# Altium project USB_Stepper_PCB.PrjPcb
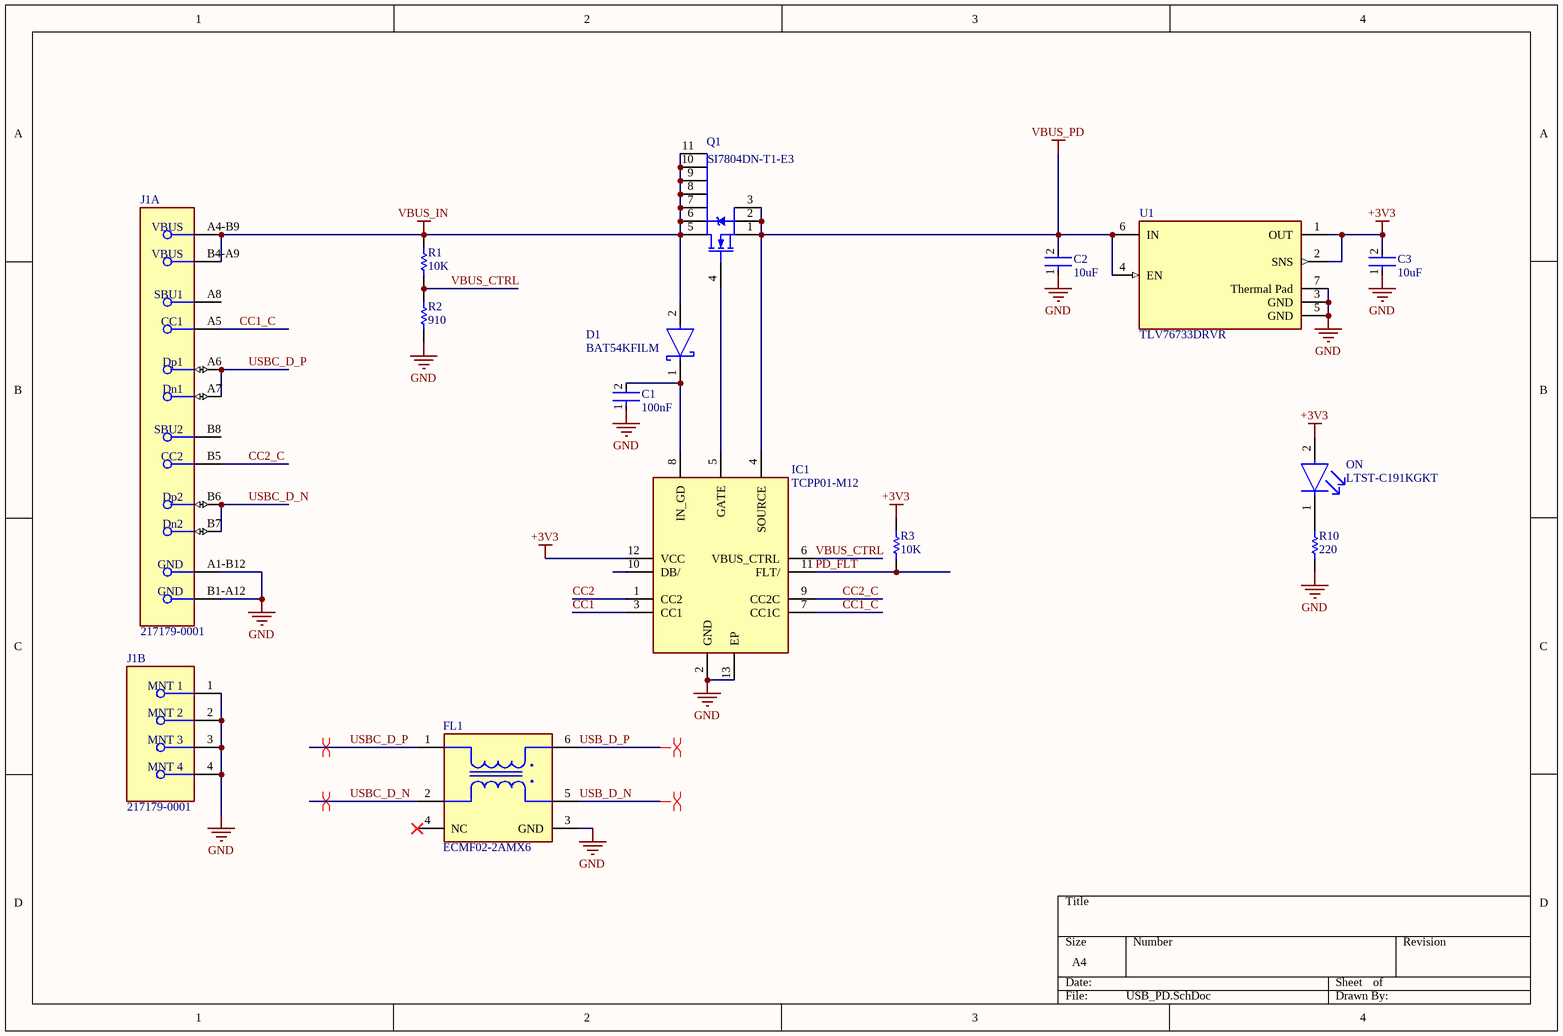
[diagram p0: USB_PD.SchDoc]
4 sheets, 36 parts. Net scope: global (net labels, ports and power ports of the same name join across sheets).
Board file: Top.PcbDoc
Sheets:
  USB_PD.SchDoc
  MCU.SchDoc
  DRIVER.SchDoc
  TOP.SchDoc

## Sheet USB_PD.SchDoc
size A4; SheetNumber: 1; SheetTotal: 4

### Parts
C1  Capacitance: 100nF  [FP-C1005-050-0_05-IPC_C]  (hidden comment: C1005X7R1H104K050BB)
C2  Capacitance: 10uF  [FP-C1608-080-IPC_A]  (hidden comment: C1608X5R1E106M080AC)
C3  Capacitance: 10uF  [FP-C1608-080-IPC_A]  (hidden comment: C1608X5R1E106M080AC)
D1  BAT54KFILM  [FP-SOD-523-MFG]
FL1  ECMF02-2AMX6  [FP-QFN-6L-MFG]
IC1  TCPP01-M12  [QFN50P300X300X100-13N-D]
J1  217179-0001  [FP-2171790001-MFG]  (parts A,B of 2)
ON  LTST-C191KGKT  [FP-LTST-C191KGKT-MFG]
Q1  SI7804DN-T1-E3  [SIS862DNT1GE3]
R1  Resistance: 10K  [RESC1005X40X25ML05T05]  (hidden comment: ERJ-2GEJ103X)
R2  ERJ-2GEJ103X: 910  [RESC1005X40X25ML05T05]  (hidden comment: ERJ-2GEJ911X)
R3  Resistance: 10K  [RESC1005X40X25ML05T05]  (hidden comment: ERJ-2GEJ103X)
R10  Resistance: 220  [RESC1005X40X25LL05T05]  (hidden comment: ERJ2RKF2200X)
U1  TLV76733DRVR  [FP-DRV0006A-IPC_C]

### Nets
+3V3: C3.2 IC1.12(VCC) ON.2(A) R3.2 U1.1(OUT) U1.2(SNS)
GND: C1.1 C2.1 C3.1 FL1.3(GND) IC1.2(GND) IC1.13(EP) J1.1(MNT_1) J1.2(MNT_2) J1.3(MNT_3) J1.4(MNT_4) J1.A1-B12(GND) J1.B1-A12(GND) R2.1 R10.2 U1.3(GND) U1.5(GND) U1.7(Thermal_Pad)
VBUS_IN: D1.2(A) J1.A4-B9(VBUS) J1.B4-A9(VBUS) Q1.5(D_1) Q1.6(D_2) Q1.7(D_3) Q1.8(D_4) Q1.9(D_5) Q1.10(D_6) Q1.11(D_7) R1.2
VBUS_PD: C2.2 IC1.4(SOURCE) Q1.1(S_1) Q1.2(S_2) Q1.3(S_3) U1.4(EN) U1.6(IN)
CC1: IC1.3(CC1)
CC1_C: IC1.7(CC1C) J1.A5(CC1)
CC2: IC1.1(CC2)
CC2_C: IC1.9(CC2C) J1.B5(CC2)
PD_~{FLT}: IC1.11(FLT/) R3.1
USB_D_N: FL1.5(D-)
USB_D_P: FL1.6(D+)
USBC_D_N: FL1.2(D-) J1.B6(Dp2) J1.B7(Dn2)
USBC_D_P: FL1.1(D+) J1.A6(Dp1) J1.A7(Dn1)
VBUS_CTRL: IC1.6(VBUS_CTRL) R1.1 R2.2
NetC1_2: C1.2 D1.1(C) IC1.8(IN_GD)
NetIC1_5: IC1.5(GATE) Q1.4(G)
NetON_1: ON.1(C) R10.1

Not connected (* = marked no-connect by the designer): FL1 4(NC)*; IC1 10(DB/); J1 A8(SBU1) B8(SBU2)

### Layout directives
differential pair: USB_D_N, USB_D_P, USBC_D_N, USBC_D_P

### Library data of the parts
C1 = CMP-2000-05393-2: Multilayer Ceramic Capacitors 100nF ±10% 50V X7R SMD 0402; Voltage: 50V; Dielectric Material: Ceramic; Min Operating Temperature: -55°C; Depth: 0.5mm; Radiation Hardening: No; RoHS Compliant: Yes; Voltage Rating (DC): 50V; Lead Free: Lead Free; Resistor Type: Ceramic; Height: 0.5mm; Dielectric: X7R; Thickness: 0.022inch; Case/Package: 0402; Case Code (Metric): 1005; Termination: SMD/SMT; Packaging: Tape and Reel; Max Operating Temperature: 125°C; Mount: Surface Mount; Package Quantity: 1; Width: 0.02inch; Weight: 2.3E-05oz; Voltage Rating: 50V; Tolerance: 10%; Construction: Flat; Case Code (Imperial): 0402; Length: 1mm; REACH SVHC: No SVHC; Series: C
C2 C3 = CMP-2000-05442-2: CAP CER 10UF 25V X5R 0603; Dielectric Material: Ceramic; Tolerance: 20%; Dielectric: X5R; Length: 1.6mm; Termination: SMD/SMT; Depth: 0.8mm; RoHS Compliant: Yes; Construction: Flat; Weight: 7.1E-05oz; Thickness: 0.039inch; Packaging: Tape and Reel; Min Operating Temperature: -55°C; Case Code (Imperial): 0603; Case/Package: 0603; Height: 0.8mm; Case Code (Metric): 1608; Voltage Rating: 25V; Resistor Type: Ceramic; Voltage Rating (DC): 25V; Max Operating Temperature: 85°C; REACH SVHC: No SVHC; Lead Free: Lead Free; Series: C; Width: 0.8mm; Mount: Surface Mount; Package Quantity: 1
D1 = CMP-12187-000026-1: DIODE SCHOTTKY 40V 300MA SOD523; Manufacturer: STMicroelectronics; Capacitance: 7pF; Value: 7pF; Max Surge Forward Current: 1.25A; Peak Reverse Current: 1uA; Max Junction Temp: +150°C; Device Class L2: Diodes; Temperature Range Low: -40°C; Category: Diode; Manufacturer Part Number: BAT54KFILM; Digikey Description: DIODE SCHOTTKY 40V 300MA SOD523; Device Class L3: Schottky Diodes; Automotive: No; Height: 0.7mm; Octopart: https://octopart.com/bat54kfilm-stmicroelectronics-39618022; ComponentLink2Description: Datasheet; Temperature Range High: +150°C; Device Class L1: Discrete Semiconductors; Max Repetitive Reverse Voltage: 40V; RoHS: TRUE; Temperature: -40°C to +150°C; ComponentLink2URL: https://www.st.com/content/ccc/resource/technical/document/datasheet/07/50/54/f2/0d/ba/4a/79/CD00001322.pdf/files/CD00001322.pdf/jcr:content/translations/en.CD00001322.pdf; Lead Free: Yes; Forward Current: 300mA; Package: SOD-523; Mouser Description: Schottky Diodes & Rectifiers schottky diode
FL1 = CMP-12075-000001-1: CMC 200MA 2LN SMD ESD; Manufacturer: STMicroelectronics; Standoff Height: 0mm; Max Junction Temp: +125°C; Series Resistance: 2.5Ω; Device Class L2: EMI / RFI Components; Device Class L1: Passive Components; Height: 0.55mm; Lead Free: Yes; Package: QFN-6L; Temperature Range Low: -55°C; Octopart: https://octopart.com/ecmf02-2amx6-stmicroelectronics-44353078; Mouser Description: TVS Diodes / ESD Suppressors ESD Mode Filter 6GHz USB 2.0 MIPI 8kV; Device Class L3: Common Mode Chokes; ComponentLink2URL: https://www.st.com/resource/en/datasheet/ecmf02-2amx6.pdf; Ipc Land Pattern Name: DFN170X150X50-6; ComponentLink2Description: Datasheet; Automotive: No; Temperature Range High: +125°C; Temperature: -55°C to +125°C; RoHS: TRUE; Digikey Description: CMC 200MA 2LN SMD ESD; Manufacturer Part Number: ECMF02-2AMX6; Category: Filter
IC1 = TCPP01-M12: Integrated Circuit; Manufacturer_Name: STMicroelectronics; Datasheet Link: https://www.st.com/resource/en/datasheet/tcpp01-m12.pdf; Height: 1mm; Manufacturer_Part_Number: TCPP01-M12; Mouser Part Number: 511-TCPP01-M12; Mouser Price/Stock: https://www.mouser.co.uk/ProductDetail/STMicroelectronics/TCPP01-M12?qs=%252B6g0mu59x7KCafIwapwG2A%3D%3D; Arrow Part Number: TCPP01-M12; Arrow Price/Stock: https://www.arrow.com/en/products/tcpp01-m12/stmicroelectronics?utm_currency=USD&region=nac
J1 = CMP-04767-000028-2: CONN RCP USB2.0 TYP C 24P SMD RA; NexarPartId: 117190526; Gender: Receptacle; Number of Contacts: 16; Current Rating: 1.25A; Voltage Rating: 30V; Min Operating Temperature: -40°C; USB Standard: USB 2.0; Height: 3.36mm; Contact Material: Gold, Nickel; Max Operating Temperature: 85°C
ON = CMP-2000-05198-4: NexarPartId: 549907; Forward Voltage: 2V; Viewing Angle: 130°; Lens Transparency: Clear; Power Rating: 75mW; Number of LEDs: 1; Luminous Intensity: 35mcd; Forward Current: 20mA; Dominant Wavelength: 571nm; Illumination Color: Green; Lens Color: Clear, Colorless; Reverse Voltage: 5V; Wavelength: 574nm; Number of Pins: 2; Packaging: Tape and Reel; Number of Elements: 1; Schedule B: 8541402000, 8541402000; Height: 550µm; Case/Package: 0603; Depth: 800µm; Max Operating Temperature: 85°C; RoHS: Compliant; Lens Style: Clear; Lead Free: Lead Free; Length: 1.6mm; Mount: Surface Mount; Test Current: 20mA; Width: 800µm; Case Code (Imperial): 0603; Min Operating Temperature: -55°C; Case Code (Metric): 1608; Radiation Hardening: No; Power Dissipation: 75mW; Color: Green
Q1 = SI7804DN-T1-E3: MOSFET (N-Channel); Manufacturer_Name: Vishay; Datasheet Link: https://componentsearchengine.com/Datasheets/1/SI7804DN-T1-E3.pdf; Height: 1.12mm; Manufacturer_Part_Number: SI7804DN-T1-E3; Mouser Part Number: 781-SI7804DN-T1-E3; Mouser Price/Stock: https://www.mouser.co.uk/ProductDetail/Vishay-Semiconductors/SI7804DN-T1-E3?qs=jcx%252B0HVgj2biudZDRPx5dA%3D%3D; Arrow Part Number: SI7804DN-T1-E3; Arrow Price/Stock: https://www.arrow.com/en/products/si7804dn-t1-e3/vishay
R1 R3 = CMP-2002-00433-1: Manufacturer: Panasonic; Part Number: ERJ-2GEJ103X
R2 = CMP-1011-00073-2: Manufacturer: Panasonic; Part Number: ERJ-2GEJ911X
R10 = CMP-2002-01131-1: Manufacturer: Panasonic; Part Number: ERJ2RKF2200X
U1 = CMP-04917-000203-1: VOLTAGE COMPARATOR

## Sheet MCU.SchDoc
size A; SheetNumber: 2; SheetTotal: 4
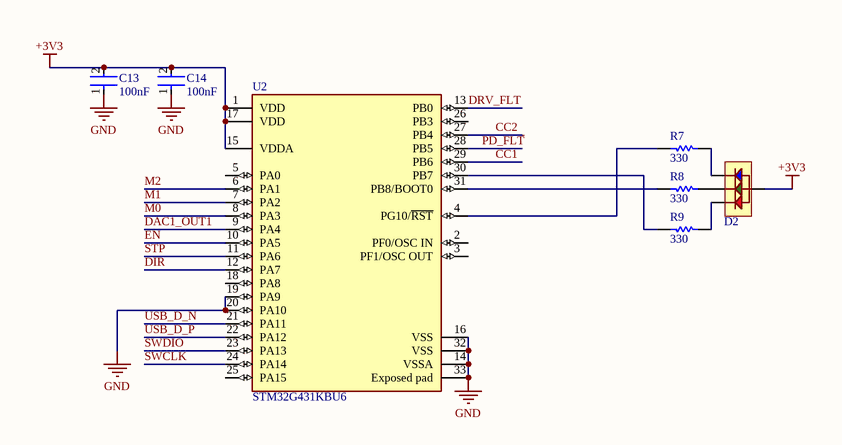
[diagram p1: MCU.SchDoc]

### Parts
C13  Capacitance: 100nF  [FP-C1005-050-0_05-IPC_C]  (hidden comment: C1005X7R1H104K050BB)
C14  Capacitance: 100nF  [FP-C1005-050-0_05-IPC_C]  (hidden comment: C1005X7R1H104K050BB)
D2  LED-RGB  [XL-2012RGBC]  (value not drawn)
R7  RESISTANCE: 330  [RESC1005X40X25NL05T05]  (hidden comment: ERJ-2GEJ331X)
R8  RESISTANCE: 330  [RESC1005X40X25NL05T05]  (hidden comment: ERJ-2GEJ331X)
R9  RESISTANCE: 330  [RESC1005X40X25NL05T05]  (hidden comment: ERJ-2GEJ331X)
U2  STM32G431KBU6  [FP-UFQFPN32-A0B8-IPC_A]

### Nets
+3V3: C13.2 C14.2 D2.3(COM) U2.1(VDD) U2.15(VDDA) U2.17(VDD)
GND: C13.1 C14.1 U2.14(VSSA) U2.16(VSS) U2.19(PA9) U2.20(PA10) U2.32(VSS) U2.33(Exposed_pad)
CC1: U2.29(PB6)
CC2: U2.27(PB4)
DAC1_OUT1: U2.9(PA4)
DIR: U2.12(PA7)
DRV_FLT: U2.13(PB0)
EN: U2.10(PA5)
M0: U2.8(PA3)
M1: U2.7(PA2)
M2: U2.6(PA1)
PD_~{FLT}: U2.28(PB5)
STP: U2.11(PA6)
SWCLK: U2.24(PA14)
SWDIO: U2.23(PA13)
USB_D_N: U2.21(PA11)
USB_D_P: U2.22(PA12)
NetD2_1: D2.1(R) R9.2
NetD2_2: D2.2(G) R8.2
NetD2_4: D2.4(B) R7.2
NetR7_1: R7.1 U2.4(PG10/~{RST})
NetR8_1: R8.1 U2.31(PB8/BOOT0)
NetR9_1: R9.1 U2.30(PB7)

Not connected (* = marked no-connect by the designer): U2 2(PF0/OSC_IN) 3(PF1/OSC_OUT) 5(PA0) 18(PA8) 25(PA15) 26(PB3)

### Library data of the parts
C13 C14 = CMP-2000-05393-2: as C1 on sheet USB_PD; Voltage: 50V; Dielectric Material: Ceramic; Min Operating Temperature: -55°C; Depth: 0.5mm; Radiation Hardening: No; RoHS Compliant: Yes; Voltage Rating (DC): 50V; Lead Free: Lead Free; Resistor Type: Ceramic; Height: 0.5mm; Dielectric: X7R; Thickness: 0.022inch; Case/Package: 0402; Case Code (Metric): 1005; Termination: SMD/SMT; Packaging: Tape and Reel; Max Operating Temperature: 125°C; Mount: Surface Mount; Package Quantity: 1; Width: 0.02inch; Weight: 2.3E-05oz; Voltage Rating: 50V; Tolerance: 10%; Construction: Flat; Case Code (Imperial): 0402; Length: 1mm; REACH SVHC: No SVHC; Series: C
D2 = XL-2012RGBC
R7-R9 = CMP-2002-00515-1: Manufacturer: Panasonic; Part Number: ERJ-2GEJ331X
U2 = CMP-12105-000119-1: IC MCU 32BIT 128KB FLSH 32UFQFPN; RoHS Compliant: Yes

## Sheet DRIVER.SchDoc
size A4; SheetNumber: 3; SheetTotal: 4
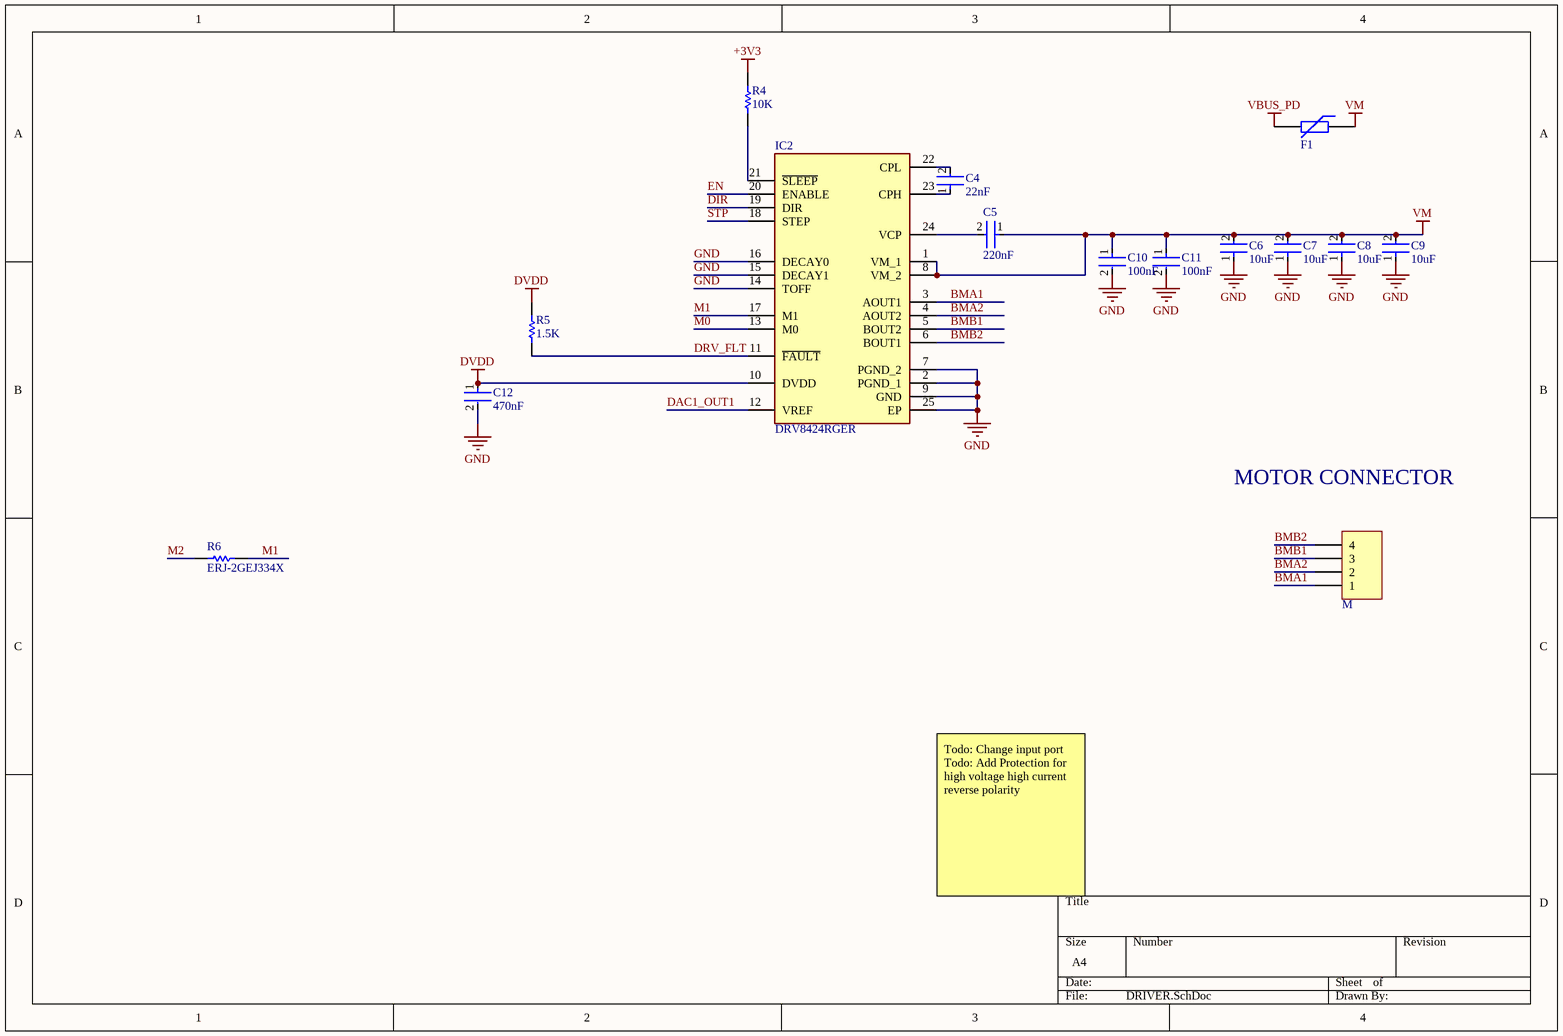
[diagram p2: DRIVER.SchDoc]

### Parts
C4  Capacitance: 22nF  [FP-C1005-050-0_05-IPC_C]  (hidden comment: C1005X7R1H223K050BB)
C5  Capacitance: 220nF  [FP-C1005-050-0_05-IPC_B]  (hidden comment: C1005X7R1V224K050BC)
C6  Capacitance: 10uF  [FP-C2012-125-0_2-IPC_B]  (hidden comment: C2012X5R1V106K125AC)
C7  Capacitance: 10uF  [FP-C2012-125-0_2-IPC_B]  (hidden comment: C2012X5R1V106K125AC)
C8  Capacitance: 10uF  [FP-C2012-125-0_2-IPC_B]  (hidden comment: C2012X5R1V106K125AC)
C9  Capacitance: 10uF  [FP-C2012-125-0_2-IPC_B]  (hidden comment: C2012X5R1V106K125AC)
C10  Capacitance: 100nF  [FP-C1005-050-0_05-IPC_C]  (hidden comment: C1005X7R1H104K050BB)
C11  Capacitance: 100nF  [FP-C1005-050-0_05-IPC_C]  (hidden comment: C1005X7R1H104K050BB)
C12  Capacitance: 470nF  [FP-C1005-050-0_05-IPC_B]  (hidden comment: C1005X5R1V474K050BC)
F1  (no value)  [R1206]
IC2  DRV8424RGER  [QFN50P400X400X100-25N-D]
M  CONN-4  [XH-4]  (value not drawn)
R4  RESISTANCE: 10K  [RESC1005X40X25ML05T05]  (hidden comment: ERJ-2GEJ103X)
R5  RESISTANCE: 1.5K  [RESC1005X40X25NL05T05]  (hidden comment: ERJ-2GEJ152X)
R6  ERJ-2GEJ334X  [RESC1005X40X25ML05T05]

### Nets
+3V3: R4.1
DVDD: C12.1 IC2.10(DVDD) R5.1
GND: C6.1 C7.1 C8.1 C9.1 C10.2 C11.2 C12.2 IC2.2(PGND_1) IC2.7(PGND_2) IC2.9(GND) IC2.14(TOFF) IC2.15(DECAY1) IC2.16(DECAY0) IC2.25(EP)
VBUS_PD: F1.2
VM: C5.1 C6.2 C7.2 C8.2 C9.2 C10.1 C11.1 F1.1 IC2.1(VM_1) IC2.8(VM_2)
BMA1: IC2.3(AOUT1) M.1
BMA2: IC2.4(AOUT2) M.2
BMB1: IC2.5(BOUT2) M.3
BMB2: IC2.6(BOUT1) M.4
DAC1_OUT1: IC2.12(VREF)
DIR: IC2.19(DIR)
DRV_FLT: IC2.11(~{FAULT}) R5.2
EN: IC2.20(ENABLE)
M0: IC2.13(M0)
M1: IC2.17(M1) R6.2
M2: R6.1
STP: IC2.18(STEP)
NetC4_1: C4.1 IC2.23(CPH)
NetC4_2: C4.2 IC2.22(CPL)
NetC5_2: C5.2 IC2.24(VCP)
NetIC2_21: IC2.21(~{SLEEP}) R4.2

### Notes on the sheet
- MOTOR CONNECTOR
- Todo: Change input port
  Todo: Add Protection for high voltage high current reverse polarity

### Library data of the parts
C4 = CMP-08246-004483-1: Multilayer Ceramic Capacitors 22nF ±10% 50V X7R SMD 0402; Radiation Hardening: No; Voltage Rating: 50V; Case Code (Imperial): 0402; Depth: 0.5mm; REACH SVHC: No SVHC; Dielectric Material: Ceramic; Package Quantity: 1; Length: 1mm; Case/Package: 0402; Voltage Rating (DC): 50V; Tolerance: 10%; Resistor Type: Ceramic; Thickness: 0.022inch; Weight: 2.3E-05oz; Min Operating Temperature: -55°C; Dielectric: X7R; RoHS Compliant: Yes; Number of Pins: 2; Termination: SMD/SMT; Mount: Surface Mount; Series: C; Height: 0.5mm; Max Operating Temperature: 125°C; Packaging: Tape and Reel; Case Code (Metric): 1005; Width: 0.02inch; Construction: Flat; Lead Free: Lead Free
C5 = CMP-08246-006551-1: Multilayer Ceramic Capacitors 220nF ±10% 35V X7R SMD 0402; Thickness: 0.022inch; Mount: Surface Mount; Width: 0.02inch; Voltage Rating (DC): 35V; Package Quantity: 10000; Case Code (Imperial): 0402; Height: 0.5mm; Termination: SMD/SMT; Weight: 2.3E-05oz; RoHS Compliant: Yes; Min Operating Temperature: -55°C; Case/Package: 0402; Length: 0.039inch; Max Operating Temperature: 125°C; Dielectric Material: Ceramic; Dielectric: X7R; Tolerance: 10%; Packaging: Tape and Reel; Voltage Rating: 35V; Lead Free: Lead Free; Case Code (Metric): 1005
C6-C9 = CMP-08246-003469-1: Multilayer Ceramic Capacitors 10μF ±10% 35V X5R SMD 0805; Packaging: Tape and Reel; RoHS Compliant: Yes; Mount: Surface Mount; Series: C; Case/Package: 0805; Voltage Rating (DC): 35V; Lead Free: Lead Free; Weight: 0.000194oz; Max Operating Temperature: 85°C; Tolerance: 10%; Thickness: 0.057inch; Voltage Rating: 35V; Height: 1.25mm; Length: 0.079inch; Dielectric Material: Ceramic; Case Code (Imperial): 0805; Dielectric: X5R; Case Code (Metric): 2012; Min Operating Temperature: -55°C; Termination: SMD/SMT; Package Quantity: 2000; Width: 1.25mm; REACH SVHC: No SVHC
C10 C11 = CMP-2000-05393-2: as C1 on sheet USB_PD; Voltage: 50V; Dielectric Material: Ceramic; Min Operating Temperature: -55°C; Depth: 0.5mm; Radiation Hardening: No; RoHS Compliant: Yes; Voltage Rating (DC): 50V; Lead Free: Lead Free; Resistor Type: Ceramic; Height: 0.5mm; Dielectric: X7R; Thickness: 0.022inch; Case/Package: 0402; Case Code (Metric): 1005; Termination: SMD/SMT; Packaging: Tape and Reel; Max Operating Temperature: 125°C; Mount: Surface Mount; Package Quantity: 1; Width: 0.02inch; Weight: 2.3E-05oz; Voltage Rating: 50V; Tolerance: 10%; Construction: Flat; Case Code (Imperial): 0402; Length: 1mm; REACH SVHC: No SVHC; Series: C
C12 = CMP-08246-003870-1: Multilayer Ceramic Capacitors 470nF ±10% 35V X5R SMD 0402; Voltage Rating: 35V; Package Quantity: 10000; RoHS Compliant: Yes; Height: 0.5mm; Termination: SMD/SMT; Tolerance: 10%; Length: 0.039inch; Dielectric Material: Ceramic; Dielectric: X5R; Min Operating Temperature: -55°C; Case Code (Imperial): 0402; Mount: Surface Mount; Max Operating Temperature: 85°C; Voltage Rating (DC): 35V; Packaging: Tape and Reel; Width: 0.02inch; Case/Package: 0402; Series: C; Weight: 2.3E-05oz; Case Code (Metric): 1005; Lead Free: Lead Free; Thickness: 0.022inch
F1 = PTC: Published: 24-Mar-1999; PackageVersion: Mar-2003; PackageReference: 6-0805
IC2 = DRV8424RGER: Integrated Circuit; Manufacturer_Name: Texas Instruments; Datasheet Link: https://www.ti.com/lit/ds/symlink/drv8424e.pdf?ts=1606468050255; Height: 1mm; Manufacturer_Part_Number: DRV8424RGER; Mouser Part Number: 595-DRV8424RGER; Mouser Price/Stock: https://www.mouser.co.uk/ProductDetail/Texas-Instruments/DRV8424RGER?qs=zW32dvEIR3vjkIn0AjQrCA%3D%3D; Arrow Part Number: DRV8424RGER; Arrow Price/Stock: null?region=nac
R4 = CMP-2002-00433-1: Manufacturer: Panasonic; Part Number: ERJ-2GEJ103X
R5 = CMP-1011-00078-2: Manufacturer: Panasonic; Part Number: ERJ-2GEJ152X
R6 = CMP-1011-00134-2: Manufacturer: Panasonic; Part Number: ERJ-2GEJ334X

## Sheet TOP.SchDoc
size A; SheetNumber: 4; SheetTotal: 4

## Nets that join several sheets
+3V3: USB_PD (6 pins), MCU (6 pins), DRIVER (R4.1)
GND: USB_PD (17 pins), MCU (8 pins), DRIVER (14 pins)
VBUS_PD: USB_PD (7 pins), DRIVER (F1.2)
CC1: USB_PD (IC1.3), MCU (U2.29)
CC2: USB_PD (IC1.1), MCU (U2.27)
DAC1_OUT1: MCU (U2.9), DRIVER (IC2.12)
DIR: MCU (U2.12), DRIVER (IC2.19)
DRV_FLT: MCU (U2.13), DRIVER (IC2.11 R5.2)
EN: MCU (U2.10), DRIVER (IC2.20)
M0: MCU (U2.8), DRIVER (IC2.13)
M1: MCU (U2.7), DRIVER (IC2.17 R6.2)
M2: MCU (U2.6), DRIVER (R6.1)
PD_~{FLT}: USB_PD (IC1.11 R3.1), MCU (U2.28)
STP: MCU (U2.11), DRIVER (IC2.18)
USB_D_N: USB_PD (FL1.5), MCU (U2.21)
USB_D_P: USB_PD (FL1.6), MCU (U2.22)